# Altium project Sayma_RTM.PrjPcb (part 10 of 11)

## Sheet CLK_HMC7043.SchDoc: Sayma RTM
size 420 x 297 mm; Author: G.Kasprowicz; CompanyName: WUT ISE; DrawnBy: G.Kasprowicz; Organization: WUT ISE; Address1: PW ISE; Address2: Nowowiejska 15/19 00-665 Warsaw; Address3: gkasprow@gmail.com; DocumentNumber: 5; Revision: 1.0; SheetNumber: 5; SheetTotal: 18; ModifiedBy: -; CheckedDate: -; Title2: HMC7043 clock distribution; DivGrp: WUT ISE; Designer: G.Kasprowicz; ModifiedDate: -; ProjectName: Sensor Box
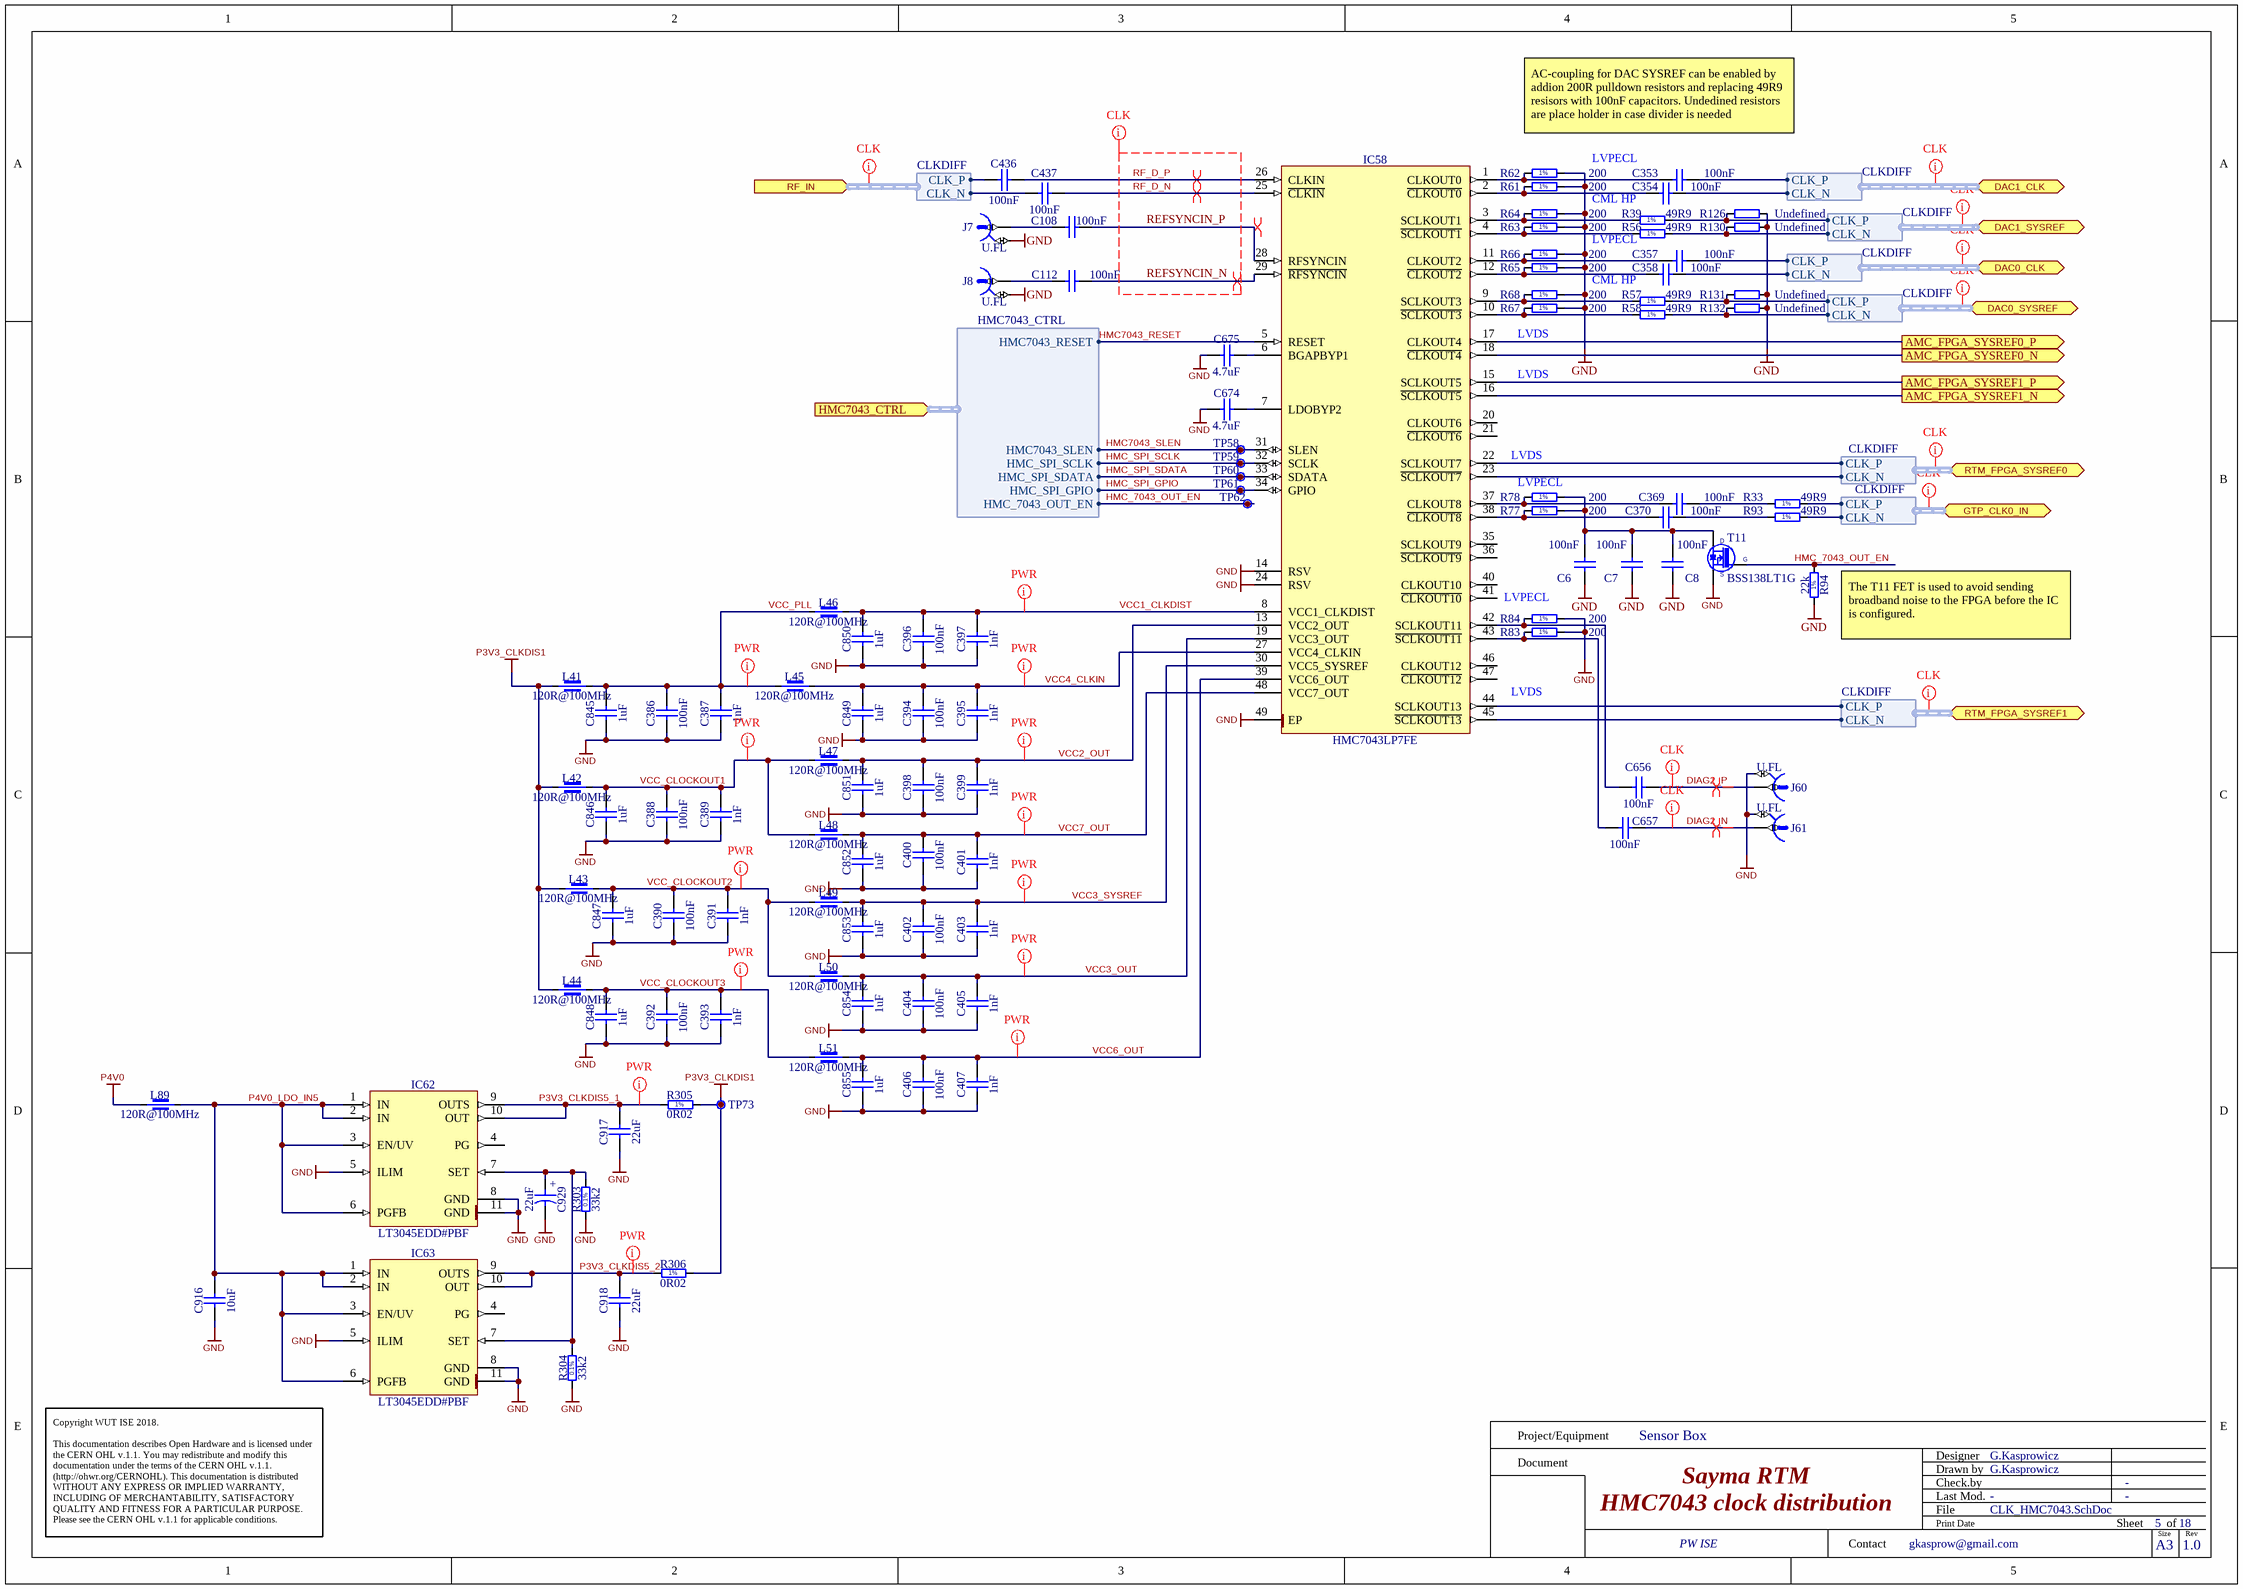
[diagram p15: CLK_HMC7043.SchDoc]

### Parts
C6  100nF  [CAPC0603X33N]
C7  100nF  [CAPC0603X33N]
C8  100nF  [CAPC0603X33N]
C108  100nF  [CAPC0603X33N]
C112  100nF  [CAPC0603X33N]
C353  100nF  [CAPC0603X33N]
C354  100nF  [CAPC0603X33N]
C357  100nF  [CAPC0603X33N]
C358  100nF  [CAPC0603X33N]
C369  100nF  [CAPC0603X33N]
C370  100nF  [CAPC0603X33N]
C386  100nF  [CAPC0603X33N]
C387  1nF  [CAPC0603X33N]
C388  100nF  [CAPC0603X33N]
C389  1nF  [CAPC0603X33N]
C390  100nF  [CAPC0603X33N]
C391  1nF  [CAPC0603X33N]
C392  100nF  [CAPC0603X33N]
C393  1nF  [CAPC0603X33N]
C394  100nF  [CAPC0603X33N]
C395  1nF  [CAPC0603X33N]
C396  100nF  [CAPC0603X33N]
C397  1nF  [CAPC0603X33N]
C398  100nF  [CAPC0603X33N]
C399  1nF  [CAPC0603X33N]
C400  100nF  [CAPC0603X33N]
C401  1nF  [CAPC0603X33N]
C402  100nF  [CAPC0603X33N]
C403  1nF  [CAPC0603X33N]
C404  100nF  [CAPC0603X33N]
C405  1nF  [CAPC0603X33N]
C406  100nF  [CAPC0603X33N]
C407  1nF  [CAPC0603X33N]
C436  100nF  [CAPC0603X33N]
C437  100nF  [CAPC0603X33N]
C656  100nF  [CAPC0603X33N]
C657  100nF  [CAPC0603X33N]
C674  4.7uF  [CAPC1608X90N]
C675  4.7uF  [CAPC1608X90N]
C845  1uF  [CAPC1005X55N]
C846  1uF  [CAPC1005X55N]
C847  1uF  [CAPC1005X55N]
C848  1uF  [CAPC1005X55N]
C849  1uF  [CAPC1005X55N]
C850  1uF  [CAPC1005X55N]
C851  1uF  [CAPC1005X55N]
C852  1uF  [CAPC1005X55N]
C853  1uF  [CAPC1005X55N]
C854  1uF  [CAPC1005X55N]
C855  1uF  [CAPC1005X55N]
C916  10uF  [CAPC1608X87N]
C917  22uF  [CAPC2012X135N]
C918  22uF  [CAPC2012X135N]
C929  22uF  [CAPMP3216X180N]
IC58  HMC7043LP7FE  [QFN50P700X700X100-49N-S565]
IC62  LT3045EDD#PBF  [SON50P300X300X80-11N-R175X248]
IC63  LT3045EDD#PBF  [SON50P300X300X80-11N-R175X248]
J7  U.FL  [HIROSE_U.FL-R-SMT-1(10)]
J8  U.FL  [HIROSE_U.FL-R-SMT-1(10)]
J60  U.FL  [HIROSE_U.FL-R-SMT-1(10)]
J61  U.FL  [HIROSE_U.FL-R-SMT-1(10)]
L41  120R@100MHz  [INDC1608X95N]
L42  120R@100MHz  [INDC1608X95N]
L43  120R@100MHz  [INDC1608X95N]
L44  120R@100MHz  [INDC1608X95N]
L45  120R@100MHz  [INDC1608X95N]
L46  120R@100MHz  [INDC1608X95N]
L47  120R@100MHz  [INDC1608X95N]
L48  120R@100MHz  [INDC1608X95N]
L49  120R@100MHz  [INDC1608X95N]
L50  120R@100MHz  [INDC1608X95N]
L51  120R@100MHz  [INDC1608X95N]
L89  120R@100MHz  [INDC1608X95N]
R33  49R9  [RESC1005X40N]
R39  49R9  [RESC1005X40N]
R56  49R9  [RESC1005X40N]
R57  49R9  [RESC1005X40N]
R58  49R9  [RESC1005X40N]
R61  200  [RESC1005X40N]
R62  200  [RESC1005X40N]
R63  200  [RESC1005X40N]
R64  200  [RESC1005X40N]
R65  200  [RESC1005X40N]
R66  200  [RESC1005X40N]
R67  200  [RESC1005X40N]
R68  200  [RESC1005X40N]
R77  200  [RESC1005X40N]
R78  200  [RESC1005X40N]
R83  200  [RESC1005X40N]
R84  200  [RESC1005X40N]
R93  49R9  [RESC1005X40N]
R94  22k  [RESC1005X40N]
R126  Undefined  [RESC1005X40N]
R130  Undefined  [RESC1005X40N]
R131  Undefined  [RESC1005X40N]
R132  Undefined  [RESC1005X40N]
R303  33k2  [RESC1608X55N]
R304  33k2  [RESC1608X55N]
R305  0R02  [RESC3216X80N]
R306  0R02  [RESC3216X80N]
T11  BSS138LT1G  [SOT95P240X110-3N]
TP58  Test Point  [TPS127]  (value not drawn)
TP59  Test Point  [TPS127]  (value not drawn)
TP60  Test Point  [TPS127]  (value not drawn)
TP61  Test Point  [TPS127]  (value not drawn)
TP62  Test Point  [TPS127]  (value not drawn)
TP73  Test Point  [TPS127]  (value not drawn)

### Ports
AMC_FPGA_SYSREF0_N (out), AMC_FPGA_SYSREF0_P (out), AMC_FPGA_SYSREF1_N (out), AMC_FPGA_SYSREF1_P (out), DAC0_CLK (bidir, harness CLKDIFF), DAC0_SYSREF (bidir, harness CLKDIFF), DAC1_CLK (bidir, harness CLKDIFF), DAC1_SYSREF (bidir, harness CLKDIFF), GTP_CLK0_IN (bidir, harness CLKDIFF), HMC7043_CTRL (in, harness HMC7043_CTRL), RF_IN (in, harness CLKDIFF), RTM_FPGA_SYSREF0 (bidir, harness CLKDIFF), RTM_FPGA_SYSREF1 (bidir, harness CLKDIFF)

### Harnesses
HMC7043_CTRL: HMC7043_RESET, HMC_SPI_SDATA, HMC7043_SLEN, HMC_SPI_SCLK, HMC_SPI_GPIO, HMC_7043_OUT_EN
CLKDIFF: CLK_P, CLK_N
CLKDIFF: CLK_N, CLK_P

### Nets
GND: C6.1 C7.1 C8.1 C386.1 C387.1 C388.1 C389.1 C390.1 C391.1 C392.1 C393.1 C394.1 C395.1 C396.1 C397.1 C398.1 C399.1 C400.1 C401.1 C402.1 C403.1 C404.1 C405.1 C406.1 C407.1 C674.1 C675.1 C845.2 C846.2 C847.2 C848.2 C849.2 C850.2 C851.2 C852.2 C853.2 C854.2 C855.2 C916.1 C917.1 C918.1 C929.2 IC58.14(RSV) IC58.24(RSV) IC58.49(EP) IC62.5(ILIM) IC62.8(GND) IC62.11(GND) IC63.5(ILIM) IC63.8(GND) IC63.11(GND) J7.2 J8.2 J60.2 J61.2 R61.2 R62.2 R63.2 R64.2 R65.2 R66.2 R67.2 R68.2 R83.2 R84.2 R94.1 R126.2 R130.2 R131.2 R132.2 R303.1 R304.1 T11.2(S)
P3V3_CLKDIS1: L41.1 L42.1 L43.1 L44.1 R305.2 R306.2 TP73.1
P4V0: L89.1
AMC_LVDS.LVDS21_N: IC58.18(~{CLKOUT4}) ; port AMC_FPGA_SYSREF0_N
AMC_LVDS.LVDS21_P: IC58.17(CLKOUT4) ; port AMC_FPGA_SYSREF0_P
AMC_LVDS.LVDS30_N: IC58.16(~{SCLKOUT5}) ; port AMC_FPGA_SYSREF1_N
AMC_LVDS.LVDS30_P: IC58.15(SCLKOUT5) ; port AMC_FPGA_SYSREF1_P
DAC_CLK_N: C354.2 ; port DAC1_CLK.CLK_N
DAC_CLK_N: C358.2 ; port DAC0_CLK.CLK_N  [a separate net that carries the same name]
DAC_CLK_P: C353.2 ; port DAC1_CLK.CLK_P
DAC_CLK_P: C357.2 ; port DAC0_CLK.CLK_P  [a separate net that carries the same name]
DAC_SYSREF_N: R56.2 R130.1 ; port DAC1_SYSREF.CLK_N
DAC_SYSREF_N: R58.2 R132.1 ; port DAC0_SYSREF.CLK_N  [a separate net that carries the same name]
DAC_SYSREF_P: R39.2 R126.1 ; port DAC1_SYSREF.CLK_P
DAC_SYSREF_P: R57.2 R131.1 ; port DAC0_SYSREF.CLK_P  [a separate net that carries the same name]
DIAG2_N: C657.2 J61.1
DIAG2_P: C656.2 J60.1
GT_CLK0_IN_N: R93.2 ; port GTP_CLK0_IN.CLK_N
GT_CLK0_IN_P: R33.2 ; port GTP_CLK0_IN.CLK_P
HMC7043_RESET: IC58.5(RESET) ; port HMC7043_CTRL.HMC7043_RESET
HMC7043_SLEN: IC58.31(SLEN) TP58.1 ; port HMC7043_CTRL.HMC7043_SLEN
HMC_7043_OUT_EN: R94.2 T11.1(G) TP62.1 ; port HMC7043_CTRL.HMC_7043_OUT_EN
HMC_SPI_GPIO: IC58.34(GPIO) TP61.1 ; port HMC7043_CTRL.HMC_SPI_GPIO
HMC_SPI_SCLK: IC58.32(SCLK) TP59.1 ; port HMC7043_CTRL.HMC_SPI_SCLK
HMC_SPI_SDATA: IC58.33(SDATA) TP60.1 ; port HMC7043_CTRL.HMC_SPI_SDATA
P3V3_CLKDIS5_1: C917.2 IC62.9(OUTS) IC62.10(OUT) R305.1
P3V3_CLKDIS5_2: C918.2 IC63.9(OUTS) IC63.10(OUT) R306.1
P4V0_LDO_IN5: C916.2 IC62.1(IN) IC62.2(IN) IC62.3(EN/UV) IC62.6(PGFB) IC63.1(IN) IC63.2(IN) IC63.3(EN/UV) IC63.6(PGFB) L89.2
REFSYNCIN_N: C112.2 IC58.29(~{RFSYNCIN})
REFSYNCIN_P: C108.2 IC58.28(RFSYNCIN)
RF_D_N: C437.2 IC58.25(~{CLKIN})
RF_D_P: C436.2 IC58.26(CLKIN)
RF_OUT_N: C437.1 ; port RF_IN.CLK_N
RF_OUT_P: C436.1 ; port RF_IN.CLK_P
RTM_FPGA_SYSREF0_N: IC58.23(~{SCLKOUT7}) ; port RTM_FPGA_SYSREF0.CLK_N
RTM_FPGA_SYSREF0_P: IC58.22(SCLKOUT7) ; port RTM_FPGA_SYSREF0.CLK_P
RTM_FPGA_SYSREF1_N: IC58.45(~{SCLKOUT13}) ; port RTM_FPGA_SYSREF1.CLK_N
RTM_FPGA_SYSREF1_P: IC58.44(SCLKOUT13) ; port RTM_FPGA_SYSREF1.CLK_P
VCC1_CLKDIST: C396.2 C397.2 C850.1 IC58.8(VCC1_CLKDIST) L46.2
VCC2_OUT: C398.2 C399.2 C851.1 IC58.13(VCC2_OUT) L47.2
VCC3_OUT: C404.2 C405.2 C854.1 IC58.19(VCC3_OUT) L50.2
VCC3_SYSREF: C402.2 C403.2 C853.1 IC58.30(VCC5_SYSREF) L49.2
VCC4_CLKIN: C394.2 C395.2 C849.1 IC58.27(VCC4_CLKIN) L45.2
VCC6_OUT: C406.2 C407.2 C855.1 IC58.39(VCC6_OUT) L51.2
VCC7_OUT: C400.2 C401.2 C852.1 IC58.48(VCC7_OUT) L48.2
VCC_CLOCKOUT1: C388.2 C389.2 C846.1 L42.2 L47.1 L48.1
VCC_CLOCKOUT2: C390.2 C391.2 C847.1 L43.2 L49.1 L50.1
VCC_CLOCKOUT3: C392.2 C393.2 C848.1 L44.2 L51.1
VCC_PLL: C386.2 C387.2 C845.1 L41.2 L45.1 L46.1
NetC6_2: C6.2 C7.2 C8.2 R77.2 R78.2 T11.3(D)
NetC108_1: C108.1 J7.1
NetC112_1: C112.1 J8.1
NetC353_1: C353.1 IC58.1(CLKOUT0) R62.1
NetC354_1: C354.1 IC58.2(~{CLKOUT0}) R61.1
NetC357_1: C357.1 IC58.11(CLKOUT2) R66.1
NetC358_1: C358.1 IC58.12(~{CLKOUT2}) R65.1
NetC369_1: C369.1 IC58.37(CLKOUT8) R78.1
NetC369_2: C369.2 R33.1
NetC370_1: C370.1 IC58.38(~{CLKOUT8}) R77.1
NetC370_2: C370.2 R93.1
NetC656_1: C656.1 IC58.42(SCLKOUT11) R84.1
NetC657_1: C657.1 IC58.43(~{SCLKOUT11}) R83.1
NetC674_2: C674.2 IC58.7(LDOBYP2)
NetC675_2: C675.2 IC58.6(BGAPBYP1)
NetC929_1: C929.1 IC62.7(SET) IC63.7(SET) R303.2 R304.2
NetIC58_3: IC58.3(SCLKOUT1) R39.1 R64.1
NetIC58_4: IC58.4(~{SCLKOUT1}) R56.1 R63.1
NetIC58_9: IC58.9(SCLKOUT3) R57.1 R68.1
NetIC58_10: IC58.10(~{SCLKOUT3}) R58.1 R67.1

Not connected (* = marked no-connect by the designer): IC58 20(CLKOUT6) 21(~{CLKOUT6}) 35(SCLKOUT9) 36(~{SCLKOUT9}) 40(CLKOUT10) 41(~{CLKOUT10}) 46(CLKOUT12) 47(~{CLKOUT12}); IC62 4(PG); IC63 4(PG)

### Layout directives
net class CLK: (no net found under the mark), DIAG2_N, DIAG2_P, REFSYNCIN_N, REFSYNCIN_P, RF_D_N, RF_D_P
differential pair: DIAG2_N, DIAG2_P, REFSYNCIN_N, REFSYNCIN_P, RF_D_N, RF_D_P
net class PWR: P3V3_CLKDIS5_1, P3V3_CLKDIS5_2, VCC1_CLKDIST, VCC2_OUT, VCC3_OUT, VCC3_SYSREF, VCC4_CLKIN, VCC6_OUT, VCC7_OUT, VCC_CLOCKOUT1, VCC_CLOCKOUT2, VCC_CLOCKOUT3, VCC_PLL

### Notes on the sheet
- AC-coupling for DAC SYSREF can be enabled by addion 200R pulldown resistors and replacing 49R9 resisors with 100nF capacitors. Undedined resistors are place holder in case divider is needed
- LVPECL
- CML HP
- LVDS
- (near R78) LVPECL
- (near R84) LVPECL
- (near R94) The T11 FET is used to avoid sending broadband noise to the FPGA before the IC is configured.
- Project/Equipment
- Document
- Designer
- Drawn by
- Check.by
- Copyright WUT ISE 2018.
  This documentation describes Open Hardware and is licensed under the CERN OHL v.1.1. You may redistribute and modify this documentation under the terms of the CERN OHL v.1.1. (http://ohwr.org/CERNOHL). This documentation is distributed WITHOUT ANY EXPRESS OR IMPLIED WARRANTY, INCLUDING OF MERCHANTABILITY, SATISFACTORY QUALITY AND FITNESS FOR A PARTICULAR PURPOSE. Please see the CERN OHL v.1.1 for applicable conditions.
- Contact
- File
- Last Mod.
- Print Date
- Sheet
- Size
- A3
- of
- Rev
- (in symbol CTE3216-18_22UF_6.3V_10%_LESR0900) +
- (in symbol R0402_22K_1%_0.0625W_100PPM) 1%
- (in symbol R0402_49R9_1%_0.0625W_100PPM) 1%
- (in symbol R0402_200R_1%_0.0625W_100PPM) 1%
- (in symbol R0603_33K2_0.1%_0.063W_10PPM) 0.1%
- (in symbol R1206_0R02_1%_0.5W_100PPM) 1%

### Library data of the parts
C6-C8 C108 C112 C353 C354 C357 C358 C369 C370 C386 C388 C390 C392 C394 C396 C398 C400 C402 C404 C406 C436 C437 C656 C657 = CC0201_100NF_6.3V_10%_X5R: Non-polarised capacitor; Manufacturer: GENERIC; Part Description: SMD Multilayer Chip Ceramic Capacitor; Manufacturer1 Part Number: 02016D104KAT2A; Tolerance: ±10%; Voltage: 6.3V; TC: X5R; Manufacturer Part Number: CC0201_100NF_6.3V_10%_X5R; Part Number: CC0201_100NF_6.3V_10%_X5R; Component Kind: Standard; Component Type: Standard; Pin Count: 2; Value: 100nF; Status: Not Recommended; Case: 0201; Mounted: Yes; Socket: No; SMD: Yes; Sense: No; Manufacturer1 Example: AVX; Manufacturer1 ComponentHeight: 0.33mm; HelpURL: \\cern.ch\dfs\Applications\Altium\Datasheets\CC0201_X5R_AVX.pdf; Author: CERN DEM JLC; CreateDate: 03.12.2007; LatestRevisionDate: 03.12.2007
C387 C389 C391 C393 C395 C397 C399 C401 C403 C405 C407 = CC0201_1NF_16V_10%_X5R: Non-polarised capacitor; Manufacturer: GENERIC; Part Description: SMD Multilayer Chip Ceramic Capacitor; Manufacturer1 Part Number: 0201YD102KAT2A; Tolerance: ±10%; Voltage: 16V; TC: X5R; Manufacturer Part Number: CC0201_1NF_16V_10%_X5R; Part Number: CC0201_1NF_16V_10%_X5R; Value: 1nF; Component Kind: Standard; Component Type: Standard; Pin Count: 2; Status: Not Recommended; Case: 0201; Mounted: Yes; Socket: No; SMD: Yes; Sense: No; Manufacturer1 Example: AVX; Manufacturer1 ComponentHeight: 0.33mm; HelpURL: \\cern.ch\dfs\Applications\Altium\Datasheets\CC0201_X5R_AVX.pdf; Author: CERN DEM JLC; CreateDate: 03.12.2007; LatestRevisionDate: 03.12.2007
C674 C675 = CC0603_4.7UF_25V_10%_X5R: Non-polarised capacitor; Manufacturer: GENERIC; Part Description: SMD Multilayer Chip Ceramic Capacitor; Manufacturer1 Part Number: GRM188R61E475KE11D; Tolerance: ±10%; Voltage: 25V; TC: X5R; Manufacturer Part Number: CC0603_4.7UF_25V_10%_X5R; Part Number: CC0603_4.7UF_25V_10%_X5R; Value: 4.7uF; Component Kind: Standard; Component Type: Standard; Pin Count: 2; Status: None; Case: 0603; Mounted: Yes; Socket: No; SMD: Yes; Sense: No; Manufacturer1 Example: MURATA; Manufacturer1 ComponentHeight: 0.95mm; HelpURL: \\cern.ch\dfs\Applications\Altium\Datasheets\CC0603_MURATA_GRM188R61E475KE11D.pdf; Author: CERN DEM JLC; CreateDate: 10.11.2014; LatestRevisionDate: 10.11.2014
C845-C855 = CC0402_1UF_16V_10%_X5R: Non-polarised capacitor; Manufacturer: GENERIC; Part Description: SMD Multilayer Chip Ceramic Capacitor; Manufacturer1 Part Number: C1005X5R1C105KT; Tolerance: ±10%; Voltage: 16V; TC: X5R; Manufacturer Part Number: CC0402_1UF_16V_10%_X5R; Part Number: CC0402_1UF_16V_10%_X5R; Value: 1uF; Component Kind: Standard; Component Type: Standard; Pin Count: 2; Status: Preferred; Case: 0402; Mounted: Yes; Socket: No; SMD: Yes; Sense: No; Manufacturer1 Example: TDK; Manufacturer1 ComponentHeight: 0.55mm; HelpURL: \\cern.ch\dfs\Applications\Altium\Datasheets\CC0402_X5R_TDK_C.pdf; Author: CERN DEM JLC; CreateDate: 25.10.2012; LatestRevisionDate: 25.10.2012
C916 = CC0603_10uF_6.3V_20%_X5R: Non-polarised capacitor; Manufacturer: GENERIC; Part Description: SMD Multilayer Chip Ceramic Capacitor; Manufacturer1 Part Number: C0603C106M9PAC; Tolerance: ±20%; Voltage: 6.3V; TC: X5R; Manufacturer Part Number: CC0603_10uF_6.3V_20%_X5R; Part Number: CC0603_10UF_6.3V_20%_X5R; Value: 10uF; Component Kind: Standard; Component Type: Standard; Pin Count: 2; Status: Preferred; Case: 0603; Mounted: Yes; Socket: No; SMD: Yes; Sense: No; Manufacturer1 Example: KEMET; Manufacturer1 ComponentHeight: 0.95mm; HelpURL: \\cern.ch\dfs\Applications\Altium\Datasheets\CC0603_X5R_KEMET.pdf; Author: CERN DEM JLC; CreateDate: 03.12.2007; LatestRevisionDate: 03.12.2007
C917 C918 = CC0805_22UF_16V_10%_X5R: Non-polarised capacitor; Manufacturer: GENERIC; Part Description: SMD Multilayer Chip Ceramic Capacitor; Manufacturer1 Part Number: C2012X5R1C226KT; Tolerance: ±10%; Voltage: 16V; TC: X5R; Manufacturer Part Number: CC0805_22UF_16V_10%_X5R; Part Number: CC0805_22UF_16V_10%_X5R; Value: 22uF; Component Kind: Standard; Component Type: Standard; Pin Count: 2; Status: Preferred; Case: 0805; Mounted: Yes; Socket: No; SMD: Yes; Sense: No; Manufacturer1 Example: TDK; Manufacturer1 ComponentHeight: 1.35mm; HelpURL: \\cern.ch\dfs\Applications\Altium\Datasheets\CC0805_X5R_TDK_C.pdf; Author: CERN DEM JLC; CreateDate: 25.10.2012; LatestRevisionDate: 25.10.2012
C929 = CTE3216-18_22UF_6.3V_10%_LESR0900: Polarised capacitor; Manufacturer: GENERIC; Part Description: Low ESR 0R9 Solid Tantalum Chip Capacitor; Manufacturer1 Part Number: TPSA226K006R0900; Tolerance: ±10%; Voltage: 6.3V; Manufacturer Part Number: CTE3216-18_22UF_6.3V_10%_LESR0900; Part Number: CTE3216-18_22UF_6.3V_10%_LESR0900; Value: 22uF; Component Kind: Standard; Component Type: Standard; Pin Count: 2; Status: Preferred; Case: A; Mounted: Yes; Socket: No; SMD: Yes; Sense: No; Manufacturer1 Example: AVX; Manufacturer1 ComponentHeight: 1.8mm; HelpURL: \\cern.ch\dfs\Applications\Altium\Datasheets\CTE-LESR_AVX_TPS.pdf; Author: CERN DEM JLC; CreateDate: 05.05.2008; LatestRevisionDate: 20.01.2009
IC58 = HMC7043LP7FE: High Performance, 3.2 GHz, 14-Output Fanout Buffer; Manufacturer: ANALOG DEVICES; PressFit: No; Bonding: No; Manufacturer Part Number: HMC7043LP7FE; PackageDescription: QFN, 0.50mm Pitch, Square; 48 Pin, 7.00mm L X 7.00mm W X 1.00mm H Body (w/thermal Tab 5.65mm X 5.65mm), IPC Medium Density; Part Description: High Performance, 3.2GHz, 14-Output Fanout Buffer; Part Number: HMC7043LP7FE; Component Kind: Standard; Component Type: Standard; Device: HMC7043LP7FE; Pin Count: 49; Case: QFN48; Mounted: Yes; Socket: No; SMD: Yes; Sense: No; ComponentHeight: 0.9mm; Author: CERN DEM BC; HelpURL: \\cern.ch\dfs\Applications\Altium\Datasheets\HMC7043LP7FE.pdf; CreateDate: 15.08.2016; LatestRevisionDate: 15.08.2016
IC62 IC63 = LT3045EDD#PBF: 20V, 500mA, Ultralow Noise, Ultrahigh PSRR Linear Regulator; Manufacturer: LINEAR TECHNOLOGY; PressFit: No; Bonding: No; Manufacturer Part Number: LT3045EDD#PBF; PackageDescription: SON, 0.50mm Pitch, 10-pin, 3.00mm W  X 3.00mm L X 0.80mm Height, (w/thermal tab 1.75 X 2.48 mm), IPC Medium Density; Part Description: 20V, 500mA, Ultralow Noise, Ultrahigh PSRR Linear Regulator; Part Number: LT3045EDD#PBF; Component Kind: Standard; Component Type: Standard; Device: LT3045EDD#PBF; Pin Count: 11; Case: SON10; Mounted: Yes; Socket: No; SMD: Yes; Sense: No; ComponentHeight: 0.8mm; HelpURL: \\cern.ch\dfs\Applications\Altium\Datasheets\LT3045EDD#PBF.pdf; Author: CERN DEM JLC; CreateDate: 07.12.2016; LatestRevisionDate: 07.12.2016
J7 J8 J60 J61 = HIROSE_U.FL-R-SMT-1(10): Manufacturer: HIROSE (HRS); Part Description: Up to 6GHz Ultra Small Surface Mount Male Coaxial Connectors U.FL Series; PressFit: No; Manufacturer Part Number: U.FL-R-SMT-1(10); Part Number: HIROSE_U.FL-R-SMT-1(10); Component Kind: Standard; Component Type: Standard; Pin Count: 2; Family: U.FL; Mounted: Yes; Socket: No; SMD: Yes; Sense: No; Status: None; ComponentHeight: 1.25mm; HelpURL: \\cern.ch\dfs\Applications\Altium\Datasheets\HIROSE_U.FL-R-SMT-1(10).pdf; Author: CERN DEM JLC; CreateDate: 24.03.2010; LatestRevisionDate: 24.03.2010
L41-L51 L89 = IND0603_MURATA_BLM18PG121SN1D: Manufacturer: MURATA; Part Description: SMD EMIFIL Chip Ferrite Bead; Power: 2A; Resistance: 0.05R; Manufacturer Part Number: BLM18PG121SN1D; Part Number: IND0603_MURATA_BLM18PG121SN1D; Value: 120R@100MHz; Component Kind: Standard; Component Type: Standard; Pin Count: 2; Status: None; Case: 0603; Mounted: Yes; Socket: No; SMD: Yes; Sense: No; ComponentHeight: 0.95mm; HelpURL: \\cern.ch\dfs\Applications\Altium\Datasheets\IND0603_MURATA_BLM18P.pdf; Author: CERN DEM BC; CreateDate: 27.07.2015; LatestRevisionDate: 25.10.2018
R33 R39 R56-R58 R93 = R0402_49R9_1%_0.0625W_100PPM: Resistor - 1%; Manufacturer: GENERIC; Manufacturer1 Part Number: 232270674999L or RC0402FR-0749R9L; Part Description: General Purpose Thick Film Chip Resistor; TC: ±100ppm/°C; PressFit: No; Case: 0402; Manufacturer Part Number: R0402_49R9_1%_0.0625W_100PPM; Manufacturer1 ComponentHeight: 0.4mm; Manufacturer1 Example: YAGEO PHYCOMP; Part Number: R0402_49R9_1%_0.0625W_100PPM; Pin Count: 2; Power: 0.0625W; Sense: No; SMD: Yes; Status: Not Recommended; Tolerance: ±1%; Value: 49R9; Component Kind: Standard; Component Type: Standard; Mounted: Yes; Socket: No; HelpURL: \\cern.ch\dfs\Applications\Altium\Datasheets\R0402_Phycomp_RC0402.pdf; Author: CERN DEM JLC; CreateDate: 24.10.2012; LatestRevisionDate: 24.10.2012
R61-R68 R77 R78 R83 R84 = R0402_200R_1%_0.0625W_100PPM: Resistor - 1%; Manufacturer: GENERIC; Part Description: General Purpose Thick Film Chip Resistor; Manufacturer1 Part Number: 232270672001L; TC: ±100ppm/°C; PressFit: No; Manufacturer Part Number: R0402_200R_1%_0.0625W_100PPM; Part Number: R0402_200R_1%_0.0625W_100PPM; Tolerance: ±1%; Value: 200; Component Kind: Standard; Component Type: Standard; Pin Count: 2; Status: Not Recommended; Power: 0.0625W; Case: 0402; Mounted: Yes; Sense: No; Socket: No; SMD: Yes; Manufacturer1 Example: YAGEO PHYCOMP; Manufacturer1 ComponentHeight: 0.4mm; HelpURL: \\cern.ch\dfs\Applications\Altium\Datasheets\R0402_Phycomp_RC0402.pdf; Author: CERN DEM JLC; CreateDate: 03.12.2007; LatestRevisionDate: 17.10.2012
R94 = R0402_22K_1%_0.0625W_100PPM: Resistor - 1%; Manufacturer: GENERIC; Manufacturer1 Part Number: 232270672203L; Part Description: General Purpose Thick Film Chip Resistor; TC: ±100ppm/°C; PressFit: No; Case: 0402; Manufacturer Part Number: R0402_22K_1%_0.0625W_100PPM; Manufacturer1 ComponentHeight: 0.4mm; Manufacturer1 Example: YAGEO PHYCOMP; Part Number: R0402_22K_1%_0.0625W_100PPM; Pin Count: 2; Power: 0.0625W; Sense: No; SMD: Yes; Status: Not Recommended; Tolerance: ±1%; Value: 22k; Component Kind: Standard; Component Type: Standard; Mounted: Yes; Socket: No; HelpURL: \\cern.ch\dfs\Applications\Altium\Datasheets\R0402_Phycomp_RC0402.pdf; Author: CERN DEM JLC; CreateDate: 03.12.2007; LatestRevisionDate: 17.10.2012
R126 R130-R132 = R0402_NO-VALUE: Resistor; Part Description: Reserved Footprint For a 0402 (1005) Chip Resistor; PressFit: No; Mounted: No; Part Number: R0402_NO-VALUE; Component Kind: Standard; Component Type: Standard; Pin Count: 2; Value: Undefined; Status: None; Manufacturer: Undefined; Manufacturer Part Number: R0402_NO-VALUE; Case: 0402; Sense: No; Socket: No; SMD: Yes; Manufacturer1 Example: Undefined; Manufacturer1 Part Number: Undefined; Manufacturer1 ComponentHeight: Undefined; HelpURL: Undefined; Author: CERN DEM JLC; CreateDate: 03.12.2007; LatestRevisionDate: 13.03.2008
R303 R304 = R0603_33K2_0.1%_0.063W_10PPM: Resistor - 0.1%; Manufacturer: GENERIC; Part Description: Thin Film Chip Resistor; Manufacturer1 Part Number: RN73C1J33K2BTDF; Power: 0.063W; TC: ±10ppm; PressFit: No; Manufacturer Part Number: R0603_33K2_0.1%_0.063W_10PPM; Part Number: R0603_33K2_0.1%_0.063W_10PPM; Tolerance: ±0.1%; Value: 33k2; Component Kind: Standard; Component Type: Standard; Pin Count: 2; Status: Not Recommended; Case: 0603; Mounted: Yes; Sense: No; Socket: No; SMD: Yes; Manufacturer1 Example: TYCO HOLSWORTHY; Manufacturer1 ComponentHeight: 0.5mm; HelpURL: \\cern.ch\dfs\Applications\Altium\Datasheets\R0603_Tyco_RN73.pdf; Author: CERN DEM JLC; CreateDate: 03.12.2007; LatestRevisionDate: 13.03.2008
R305 R306 = R1206_0R02_1%_0.5W_100PPM: Resistor - 1%; Manufacturer Part Number: LRF1206-R020FI; Manufacturer: TT Electronics; Part Description: Low Value Flat Chip Resistor; Power: 0.5W; TC: ±100ppm/°C; PressFit: No; Part Number: R1206_0R02_1%_0.5W_100PPM; Tolerance: ±1%; Value: 0R02; Component Kind: Standard; Component Type: Standard; Pin Count: 2; Status: None; Case: 1206; Mounted: Yes; Sense: No; Socket: No; SMD: Yes; ComponentHeight: 0.8mm; HelpURL: \\cern.ch\dfs\Applications\Altium\Datasheets\R1206_WELWYN_LRF.pdf; Author: CERN DEM JLC; CreateDate: 11.05.2010; LatestRevisionDate: 03.09.2012
T11 = BSS138LT1G: N-CHANNEL MOSFET WITH DIODE; Manufacturer: ON SEMICONDUCTOR; Part Description: 50V 200mA N-Channel Enhancement Mode Field-Effect Transistor; Bonding: No; PressFit: No; Case: SOT23-3; ComponentHeight: 1.11mm; Device: BSS138LT1G; Manufacturer Part Number: BSS138LT1G; Mounted: Yes; PackageDescription: SOT23 3-Leads, Pitch 0.95mm - Body 1.4x3mm, IPC Medium Density; Part Number: BSS138LT1G; Pin Count: 3; Sense: No; SMD: Yes; Socket: No; Component Kind: Standard; Component Type: Standard; HelpURL: \\cern.ch\dfs\Applications\Altium\Datasheets\BSS138LT1G.pdf; Author: CERN DEM JLC; CreateDate: 23.03.2009; LatestRevisionDate: 23.03.2009
TP58-TP62 TP73 = SMD_PAD_1.27X1.27MM: Part Description: 1.27mm x 1.27mm PCB Copper Area (SMD Test Point); Mounted: No; ComponentHeight: 0mm; Family: Test Point; Part Number: SMD_PAD_1.27X1.27MM; Pin Count: 1; Sense: No; SMD: Yes; Socket: No; Status: None; Component Kind: Standard (No BOM); Component Type: Standard (No BOM); HelpURL: Undefined; Author: CERN DEM JLC; CreateDate: 12.01.2008; LatestRevisionDate: 12.01.2008; PackageDescription: 1.27mm x 1.27mm PCB Copper Area (SMD Test Point)

## Sheet FPGA_7A35T_GTP.SchDoc: Sayma RTM
size 420 x 297 mm; Author: G.Kasprowicz; CompanyName: WUT ISE; DrawnBy: G.Kasprowicz; Organization: WUT ISE; Address1: PW ISE; Address2: Nowowiejska 15/19 00-665 Warsaw; Address3: gkasprow@gmail.com; DocumentNumber: 10; Revision: 1.0; SheetNumber: 10; SheetTotal: 18; ModifiedBy: -; CheckedDate: -; Title2: GTP transceivers & SATA; DivGrp: WUT ISE; Designer: G.Kasprowicz; ModifiedDate: -; ProjectName: Sensor Box
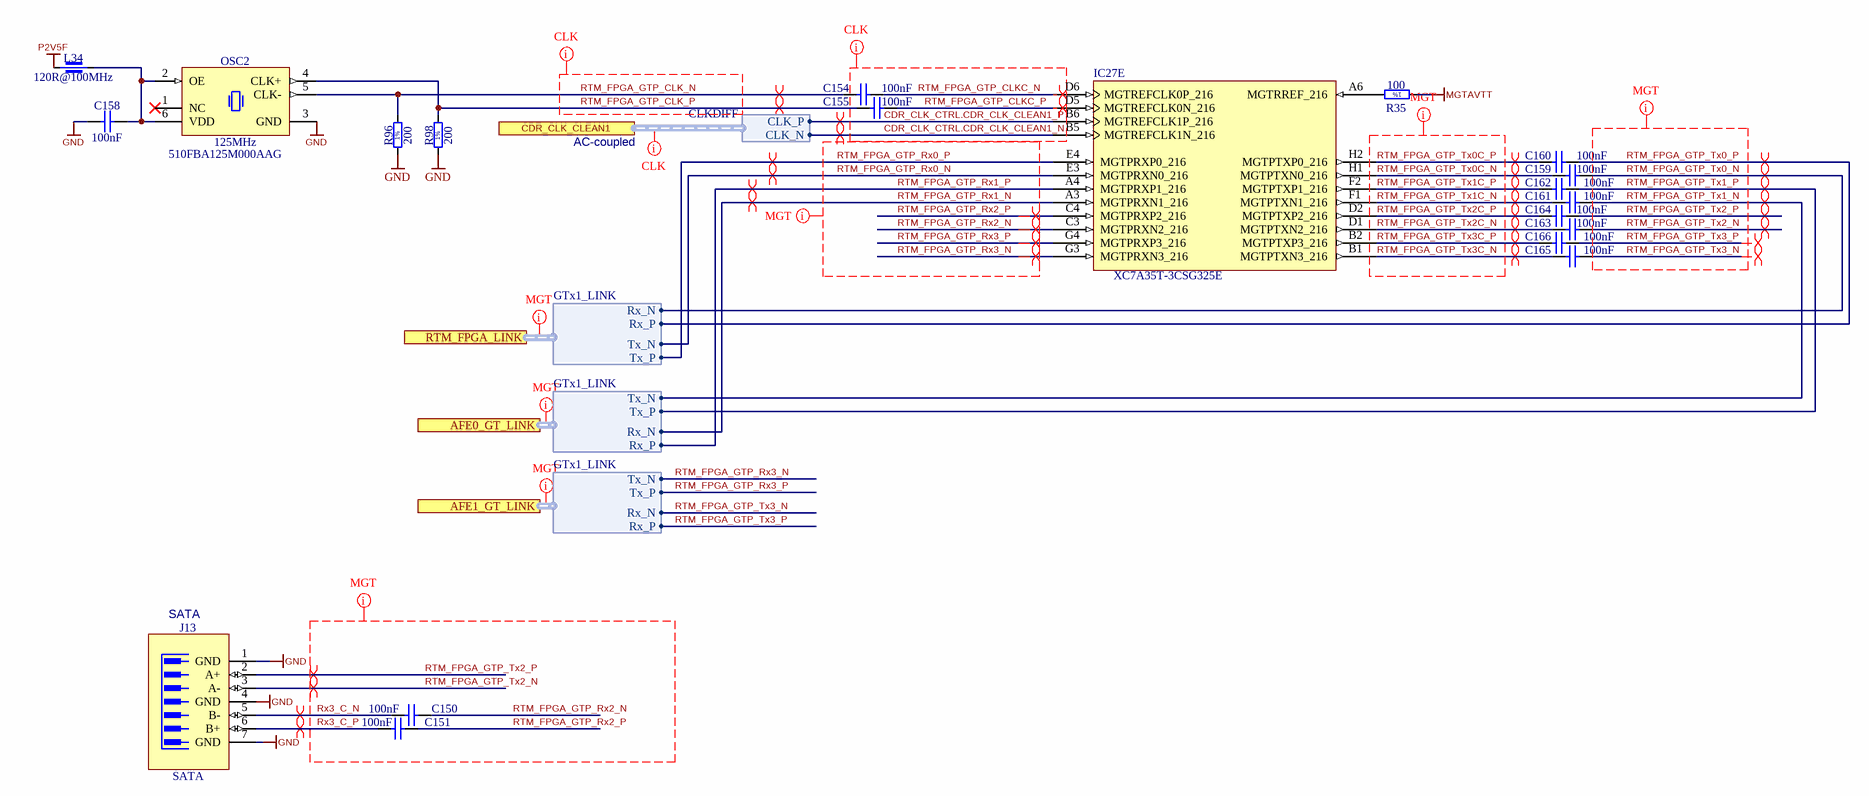
[diagram p16: FPGA_7A35T_GTP.SchDoc]

### Parts
C150  100nF  [CAPC0603X33N]
C151  100nF  [CAPC0603X33N]
C154  100nF  [CAPC0603X33N]
C155  100nF  [CAPC0603X33N]
C158  100nF  [CAPC0603X33N]
C159  100nF  [CAPC0603X33N]
C160  100nF  [CAPC0603X33N]
C161  100nF  [CAPC0603X33N]
C162  100nF  [CAPC0603X33N]
C163  100nF  [CAPC0603X33N]
C164  100nF  [CAPC0603X33N]
C165  100nF  [CAPC0603X33N]
C166  100nF  [CAPC0603X33N]
IC27  XC7A35T-3CSG325E  [CSG325]  (part E of 9)
J13  SATA  [MOLEX_67800-5005]
L34  120R@100MHz  [INDC1005X55N]
OSC2  125MHz  Manufacturer Part Number: 510FBA125M000AAG  [OSC_SILICON-LAB_SI510-6N(5X7)]
R35  100  [RESC1005X40N]
R96  200  [RESC1005X40N]
R98  200  [RESC1005X40N]

### Ports
AFE0_GT_LINK (harness GTx1_LINK), AFE1_GT_LINK (harness GTx1_LINK), CDR_CLK_CLEAN1 (harness CLKDIFF), RTM_FPGA_LINK (harness GTx1_LINK)

### Harnesses
CLKDIFF: CLK_N, CLK_P
GTx1_LINK: Rx_P, Rx_N, Tx_P, Tx_N

### Nets
GND: C158.1 J13.1(GND) J13.4(GND) J13.7(GND) OSC2.3(GND) R96.1 R98.1
MGTAVTT: R35.1
P2V5F: L34.2
CDR_CLK_CTRL.CDR_CLK_CLEAN1_N: IC27.B5(MGTREFCLK1N_216) ; port CDR_CLK_CLEAN1.CLK_N
CDR_CLK_CTRL.CDR_CLK_CLEAN1_P: IC27.B6(MGTREFCLK1P_216) ; port CDR_CLK_CLEAN1.CLK_P
RTM_FPGA_GTP_CLK_N: C154.1 OSC2.5(CLK-) R96.2
RTM_FPGA_GTP_CLK_P: C155.1 OSC2.4(CLK+) R98.2
RTM_FPGA_GTP_CLKC_N: C154.2 IC27.D6(MGTREFCLK0P_216)
RTM_FPGA_GTP_CLKC_P: C155.2 IC27.D5(MGTREFCLK0N_216)
RTM_FPGA_GTP_Rx0_N: IC27.E3(MGTPRXN0_216) ; port RTM_FPGA_LINK.Tx_N  [project net GT16TX_N]
RTM_FPGA_GTP_Rx0_P: IC27.E4(MGTPRXP0_216) ; port RTM_FPGA_LINK.Tx_P  [project net GT16TX_P]
RTM_FPGA_GTP_Rx1_N: IC27.A3(MGTPRXN1_216) ; port AFE0_GT_LINK.Rx_N
RTM_FPGA_GTP_Rx1_P: IC27.A4(MGTPRXP1_216) ; port AFE0_GT_LINK.Rx_P
RTM_FPGA_GTP_Rx2_N: C150.2 IC27.C3(MGTPRXN2_216)
RTM_FPGA_GTP_Rx2_P: C151.2 IC27.C4(MGTPRXP2_216)
RTM_FPGA_GTP_Rx3_N: IC27.G3(MGTPRXN3_216) ; port AFE1_GT_LINK.Tx_N
RTM_FPGA_GTP_Rx3_P: IC27.G4(MGTPRXP3_216) ; port AFE1_GT_LINK.Tx_P
RTM_FPGA_GTP_Tx0_N: C159.1 ; port RTM_FPGA_LINK.Rx_N  [project net GT16RX_N]
RTM_FPGA_GTP_Tx0_P: C160.1 ; port RTM_FPGA_LINK.Rx_P  [project net GT16RX_P]
RTM_FPGA_GTP_Tx0C_N: C159.2 IC27.H1(MGTPTXN0_216)
RTM_FPGA_GTP_Tx0C_P: C160.2 IC27.H2(MGTPTXP0_216)
RTM_FPGA_GTP_Tx1_N: C161.1 ; port AFE0_GT_LINK.Tx_N
RTM_FPGA_GTP_Tx1_P: C162.1 ; port AFE0_GT_LINK.Tx_P
RTM_FPGA_GTP_Tx1C_N: C161.2 IC27.F1(MGTPTXN1_216)
RTM_FPGA_GTP_Tx1C_P: C162.2 IC27.F2(MGTPTXP1_216)
RTM_FPGA_GTP_Tx2_N: C163.1 J13.3(A-)
RTM_FPGA_GTP_Tx2_P: C164.1 J13.2(A+)
RTM_FPGA_GTP_Tx2C_N: C163.2 IC27.D1(MGTPTXN2_216)
RTM_FPGA_GTP_Tx2C_P: C164.2 IC27.D2(MGTPTXP2_216)
RTM_FPGA_GTP_Tx3_N: C165.1 ; port AFE1_GT_LINK.Rx_N
RTM_FPGA_GTP_Tx3_P: C166.1 ; port AFE1_GT_LINK.Rx_P
RTM_FPGA_GTP_Tx3C_N: C165.2 IC27.B1(MGTPTXN3_216)
RTM_FPGA_GTP_Tx3C_P: C166.2 IC27.B2(MGTPTXP3_216)
Rx3_C_N: C150.1 J13.5(B-)
Rx3_C_P: C151.1 J13.6(B+)
NetC158_2: C158.2 L34.1 OSC2.2(OE) OSC2.6(VDD)
NetIC27_A6: IC27.A6(MGTRREF_216) R35.2

Not connected (* = marked no-connect by the designer): OSC2 1(NC)*

### Layout directives
net class CLK: (no net found under the mark), CDR_CLK_CTRL.CDR_CLK_CLEAN1_N, CDR_CLK_CTRL.CDR_CLK_CLEAN1_P, RTM_FPGA_GTP_CLK_N, RTM_FPGA_GTP_CLK_P, RTM_FPGA_GTP_CLKC_N, RTM_FPGA_GTP_CLKC_P
net class MGT: (no net found under the mark), RTM_FPGA_GTP_Rx0_N, RTM_FPGA_GTP_Rx0_P, RTM_FPGA_GTP_Rx1_N, RTM_FPGA_GTP_Rx1_P, RTM_FPGA_GTP_Rx2_N, RTM_FPGA_GTP_Rx2_P, RTM_FPGA_GTP_Rx3_N, RTM_FPGA_GTP_Rx3_P, RTM_FPGA_GTP_Tx0_N, RTM_FPGA_GTP_Tx0_P, RTM_FPGA_GTP_Tx0C_N, RTM_FPGA_GTP_Tx0C_P, RTM_FPGA_GTP_Tx1_N, RTM_FPGA_GTP_Tx1_P, RTM_FPGA_GTP_Tx1C_N, RTM_FPGA_GTP_Tx1C_P, RTM_FPGA_GTP_Tx2_N, RTM_FPGA_GTP_Tx2_P, RTM_FPGA_GTP_Tx2C_N, RTM_FPGA_GTP_Tx2C_P, RTM_FPGA_GTP_Tx3_N, RTM_FPGA_GTP_Tx3_P, RTM_FPGA_GTP_Tx3C_N, RTM_FPGA_GTP_Tx3C_P, Rx3_C_N, Rx3_C_P
differential pair: CDR_CLK_CTRL.CDR_CLK_CLEAN1_N, CDR_CLK_CTRL.CDR_CLK_CLEAN1_P, GT16RX_N, GT16RX_P, GT16TX_N, GT16TX_P, RTM_FPGA_GTP_CLK_N, RTM_FPGA_GTP_CLK_P, RTM_FPGA_GTP_CLKC_N, RTM_FPGA_GTP_CLKC_P, RTM_FPGA_GTP_Rx1_N, RTM_FPGA_GTP_Rx1_P, RTM_FPGA_GTP_Rx2_N, RTM_FPGA_GTP_Rx2_P, RTM_FPGA_GTP_Rx3_N, RTM_FPGA_GTP_Rx3_P, RTM_FPGA_GTP_Tx0C_N, RTM_FPGA_GTP_Tx0C_P, RTM_FPGA_GTP_Tx1_N, RTM_FPGA_GTP_Tx1_P, RTM_FPGA_GTP_Tx1C_N, RTM_FPGA_GTP_Tx1C_P, RTM_FPGA_GTP_Tx2_N, RTM_FPGA_GTP_Tx2_P, RTM_FPGA_GTP_Tx2C_N, RTM_FPGA_GTP_Tx2C_P, RTM_FPGA_GTP_Tx3_N, RTM_FPGA_GTP_Tx3_P, RTM_FPGA_GTP_Tx3C_N, RTM_FPGA_GTP_Tx3C_P, Rx3_C_N, Rx3_C_P

### Notes on the sheet
- AC-coupled
- SATA
- Project/Equipment
- Document
- Designer
- Drawn by
- Check.by
- Copyright WUT ISE 2018.
  This documentation describes Open Hardware and is licensed under the CERN OHL v.1.1. You may redistribute and modify this documentation under the terms of the CERN OHL v.1.1. (http://ohwr.org/CERNOHL). This documentation is distributed WITHOUT ANY EXPRESS OR IMPLIED WARRANTY, INCLUDING OF MERCHANTABILITY, SATISFACTORY QUALITY AND FITNESS FOR A PARTICULAR PURPOSE. Please see the CERN OHL v.1.1 for applicable conditions.
- Contact
- File
- Last Mod.
- Print Date
- Sheet
- Size
- A3
- of
- Rev
- (in symbol R0402_100R_1%_0.0625W_100PPM) 1%
- (in symbol R0402_200R_1%_0.0625W_100PPM) 1%

### Library data of the parts
C150 C151 C154 C155 C158-C166 = CC0201_100NF_6.3V_10%_X5R: Non-polarised capacitor; Manufacturer: GENERIC; Manufacturer1 Part Number: 02016D104KAT2A; Part Description: SMD Multilayer Chip Ceramic Capacitor; TC: X5R; Tolerance: ±10%; Voltage: 6.3V; Case: 0201; Manufacturer Part Number: CC0201_100NF_6.3V_10%_X5R; Manufacturer1 Example: AVX; Part Number: CC0201_100NF_6.3V_10%_X5R; Pin Count: 2; SMD: Yes; Status: Not Recommended; Value: 100nF; Component Kind: Standard; Component Type: Standard; Mounted: Yes; Socket: No; Sense: No; Manufacturer1 ComponentHeight: 0.33mm; HelpURL: \\cern.ch\dfs\Applications\Altium\Datasheets\CC0201_X5R_AVX.pdf; Author: CERN DEM JLC; CreateDate: 03.12.2007; LatestRevisionDate: 03.12.2007
IC27 = CMP-0383-00015-1: Artix-7 FPGA, 150 User I/Os, 4 GTP, 324-Ball BGA, Speed Grade 3, Extended Grade, Pb-Free; Manufacturer: Xilinx; CMTs: 5; Available User I/O: 150; GTP: 4; Speed Grades: 3; Total Block RAM: 1800 Kb; Logic Cells: 33280; ComponentLink3URL: http://www.xilinx.com/support/documentation/user_guides/ug475_7Series_Pkg_Pinout.pdf; ComponentLink3Description: Pinout; Operating Temperature Range: Extended; PackageReference: CSG-325; PackageDescription: 324-Ball Wire-Bond Chip-Scale BGA, Body 15 x 15 mm, Pitch 0.8 mm; ComponentLink4URL: http://www.xilinx.com/support/documentation/user_guides/ug475_7Series_Pkg_Pinout.pdf; ComponentLink1Description: Manufacturer URL; ComponentLink2Description: Datasheet; DatasheetVersion: Rev. 1.15; PartNumber: XC7A35T-3CSG325E; Mounting Technology: Surface Mount; ComponentLink1URL: http://www.xilinx.com/; PackageVersion: Rev. 1.11; ComponentLink2URL: http://www.xilinx.com/support/documentation/data_sheets/ds180_7Series_Overview.pdf; Maximum Distributed RAM: 400 Kb; ComponentLink4Description: Package Specification
J13 = MOLEX_67800-5005: 7 Pin SATA Receptacle; Manufacturer: MOLEX; Part Description: 1.27mm Pitch, 7 Contacts, Serial ATA High Speed Header, Straight with Locking Latch; PressFit: No; Manufacturer Part Number: 67800-5005; Part Number: MOLEX_67800-5005; Component Kind: Standard; Component Type: Standard; Pin Count: 7; Family: SATA; Mounted: Yes; Socket: No; SMD: Yes; Sense: No; Status: None; ComponentHeight: 8.4mm; HelpURL: \\cern.ch\dfs\Applications\Altium\Datasheets\MOLEX_67800-5005.pdf; Author: CERN DEM MR; CreateDate: 01.12.2016; LatestRevisionDate: 01.12.2016
L34 = IND0402_MURATA_BLM15PX121SN1D: Manufacturer: MURATA; Part Description: SMD EMIFIL Chip Ferrite Bead; Power: 2A; Resistance: 0.055R; Tolerance: ±25%; Case: 0402; ComponentHeight: 0.55mm; Manufacturer Part Number: BLM15PX121SN1D; Part Number: IND0402_MURATA_BLM15PX121SN1D; Pin Count: 2; SMD: Yes; Value: 120R@100MHz; Component Kind: Standard; Component Type: Standard; Status: None; Mounted: Yes; Socket: No; Sense: No; HelpURL: \\cern.ch\dfs\Applications\Altium\Datasheets\IND0402_MURATA_BLM15PX.pdf; Author: CERN DEM JMW; CreateDate: 19.02.2014; LatestRevisionDate: 25.10.2018
OSC2 = OSC_125MHZ_SILICON-LAB_510FBA125M000AAG: Crystal Oscillator 6 pins, Si510 (LVDS/LVPECL/HCSL/Dual CMOS); Part Description: 2.5V ±25ppm LVDS Crystal Oscillator (XO), Si510 Series; Manufacturer: SILICON LABS; PressFit: No; Bonding: No; Part Number: OSC_125MHZ_SILICON-LAB_510FBA125M000AAG; Component Kind: Standard; Component Type: Standard; PackageDescription: Oscillator Si510 Series, 6 pins, 5x7mm; Value: 125MHz; Pin Count: 6; Mounted: Yes; Socket: No; SMD: Yes; Sense: No; ComponentHeight: 1.8mm; HelpURL: \\cern.ch\dfs\Applications\Altium\Datasheets\OSC_SILICON-LAB_SI510.pdf; Author: CERN DEM JMW; CreateDate: 10.08.2015; LatestRevisionDate: 26.11.2018
R35 = R0402_100R_1%_0.0625W_100PPM: Resistor - 1%; Manufacturer: GENERIC; Manufacturer1 Part Number: 232270671001L; Part Description: General Purpose Thick Film Chip Resistor; TC: ±100ppm/°C; PressFit: No; Case: 0402; Manufacturer Part Number: R0402_100R_1%_0.0625W_100PPM; Manufacturer1 ComponentHeight: 0.4mm; Manufacturer1 Example: YAGEO PHYCOMP; Part Number: R0402_100R_1%_0.0625W_100PPM; Pin Count: 2; Power: 0.0625W; Sense: No; SMD: Yes; Status: Not Recommended; Tolerance: ±1%; Value: 100; Component Kind: Standard; Component Type: Standard; Mounted: Yes; Socket: No; HelpURL: \\cern.ch\dfs\Applications\Altium\Datasheets\R0402_Phycomp_RC0402.pdf; Author: CERN DEM JLC; CreateDate: 03.12.2007; LatestRevisionDate: 17.10.2012
R96 R98 = R0402_200R_1%_0.0625W_100PPM: Resistor - 1%; Manufacturer: GENERIC; Manufacturer1 Part Number: 232270672001L; Part Description: General Purpose Thick Film Chip Resistor; TC: ±100ppm/°C; PressFit: No; Case: 0402; Manufacturer Part Number: R0402_200R_1%_0.0625W_100PPM; Manufacturer1 ComponentHeight: 0.4mm; Manufacturer1 Example: YAGEO PHYCOMP; Part Number: R0402_200R_1%_0.0625W_100PPM; Pin Count: 2; Power: 0.0625W; Sense: No; SMD: Yes; Status: Not Recommended; Tolerance: ±1%; Value: 200; Component Kind: Standard; Component Type: Standard; Mounted: Yes; Socket: No; HelpURL: \\cern.ch\dfs\Applications\Altium\Datasheets\R0402_Phycomp_RC0402.pdf; Author: CERN DEM JLC; CreateDate: 03.12.2007; LatestRevisionDate: 17.10.2012

## Sheet FPGA_7A35T_POWER.SchDoc: Sayma RTM
size 420 x 297 mm; $$Internal___BlkDate: 23:43:25_12-13-18; $$Internal_NAME_PLACEHOLDER: a3sheet; $$Internal_Resolution: 00001mm; $$NotCommonProperty_@NAME: FPGA_7A15T_POWER; $$NotCommonProperty_@PRINTORDER: 2; $$NotCommonProperty_@SHEET: 1; $$NotCommonProperty_@SHEETTOTAL: 1; CmpIndex: 0; Drawing Author: G.Kasprowicz; Drawing Number: Sayma RTM; Drawing Project: 8 channel SAWG; Drawing Revision: 2.0; SymIndex: 2227; Author: G.Kasprowicz; CompanyName: WUT ISE; DrawnBy: G.Kasprowicz; Organization: WUT ISE; Address1: PW ISE; Address2: Nowowiejska 15/19 00-665 Warsaw; Address3: gkasprow@gmail.com; DocumentNumber: 9; Revision: 1.0; SheetNumber: 9; SheetTotal: 18; ModifiedBy: -; CheckedDate: -; Title2: FPGA supply; DivGrp: WUT ISE; Designer: G.Kasprowicz; ModifiedDate: -; ProjectName: Sensor Box
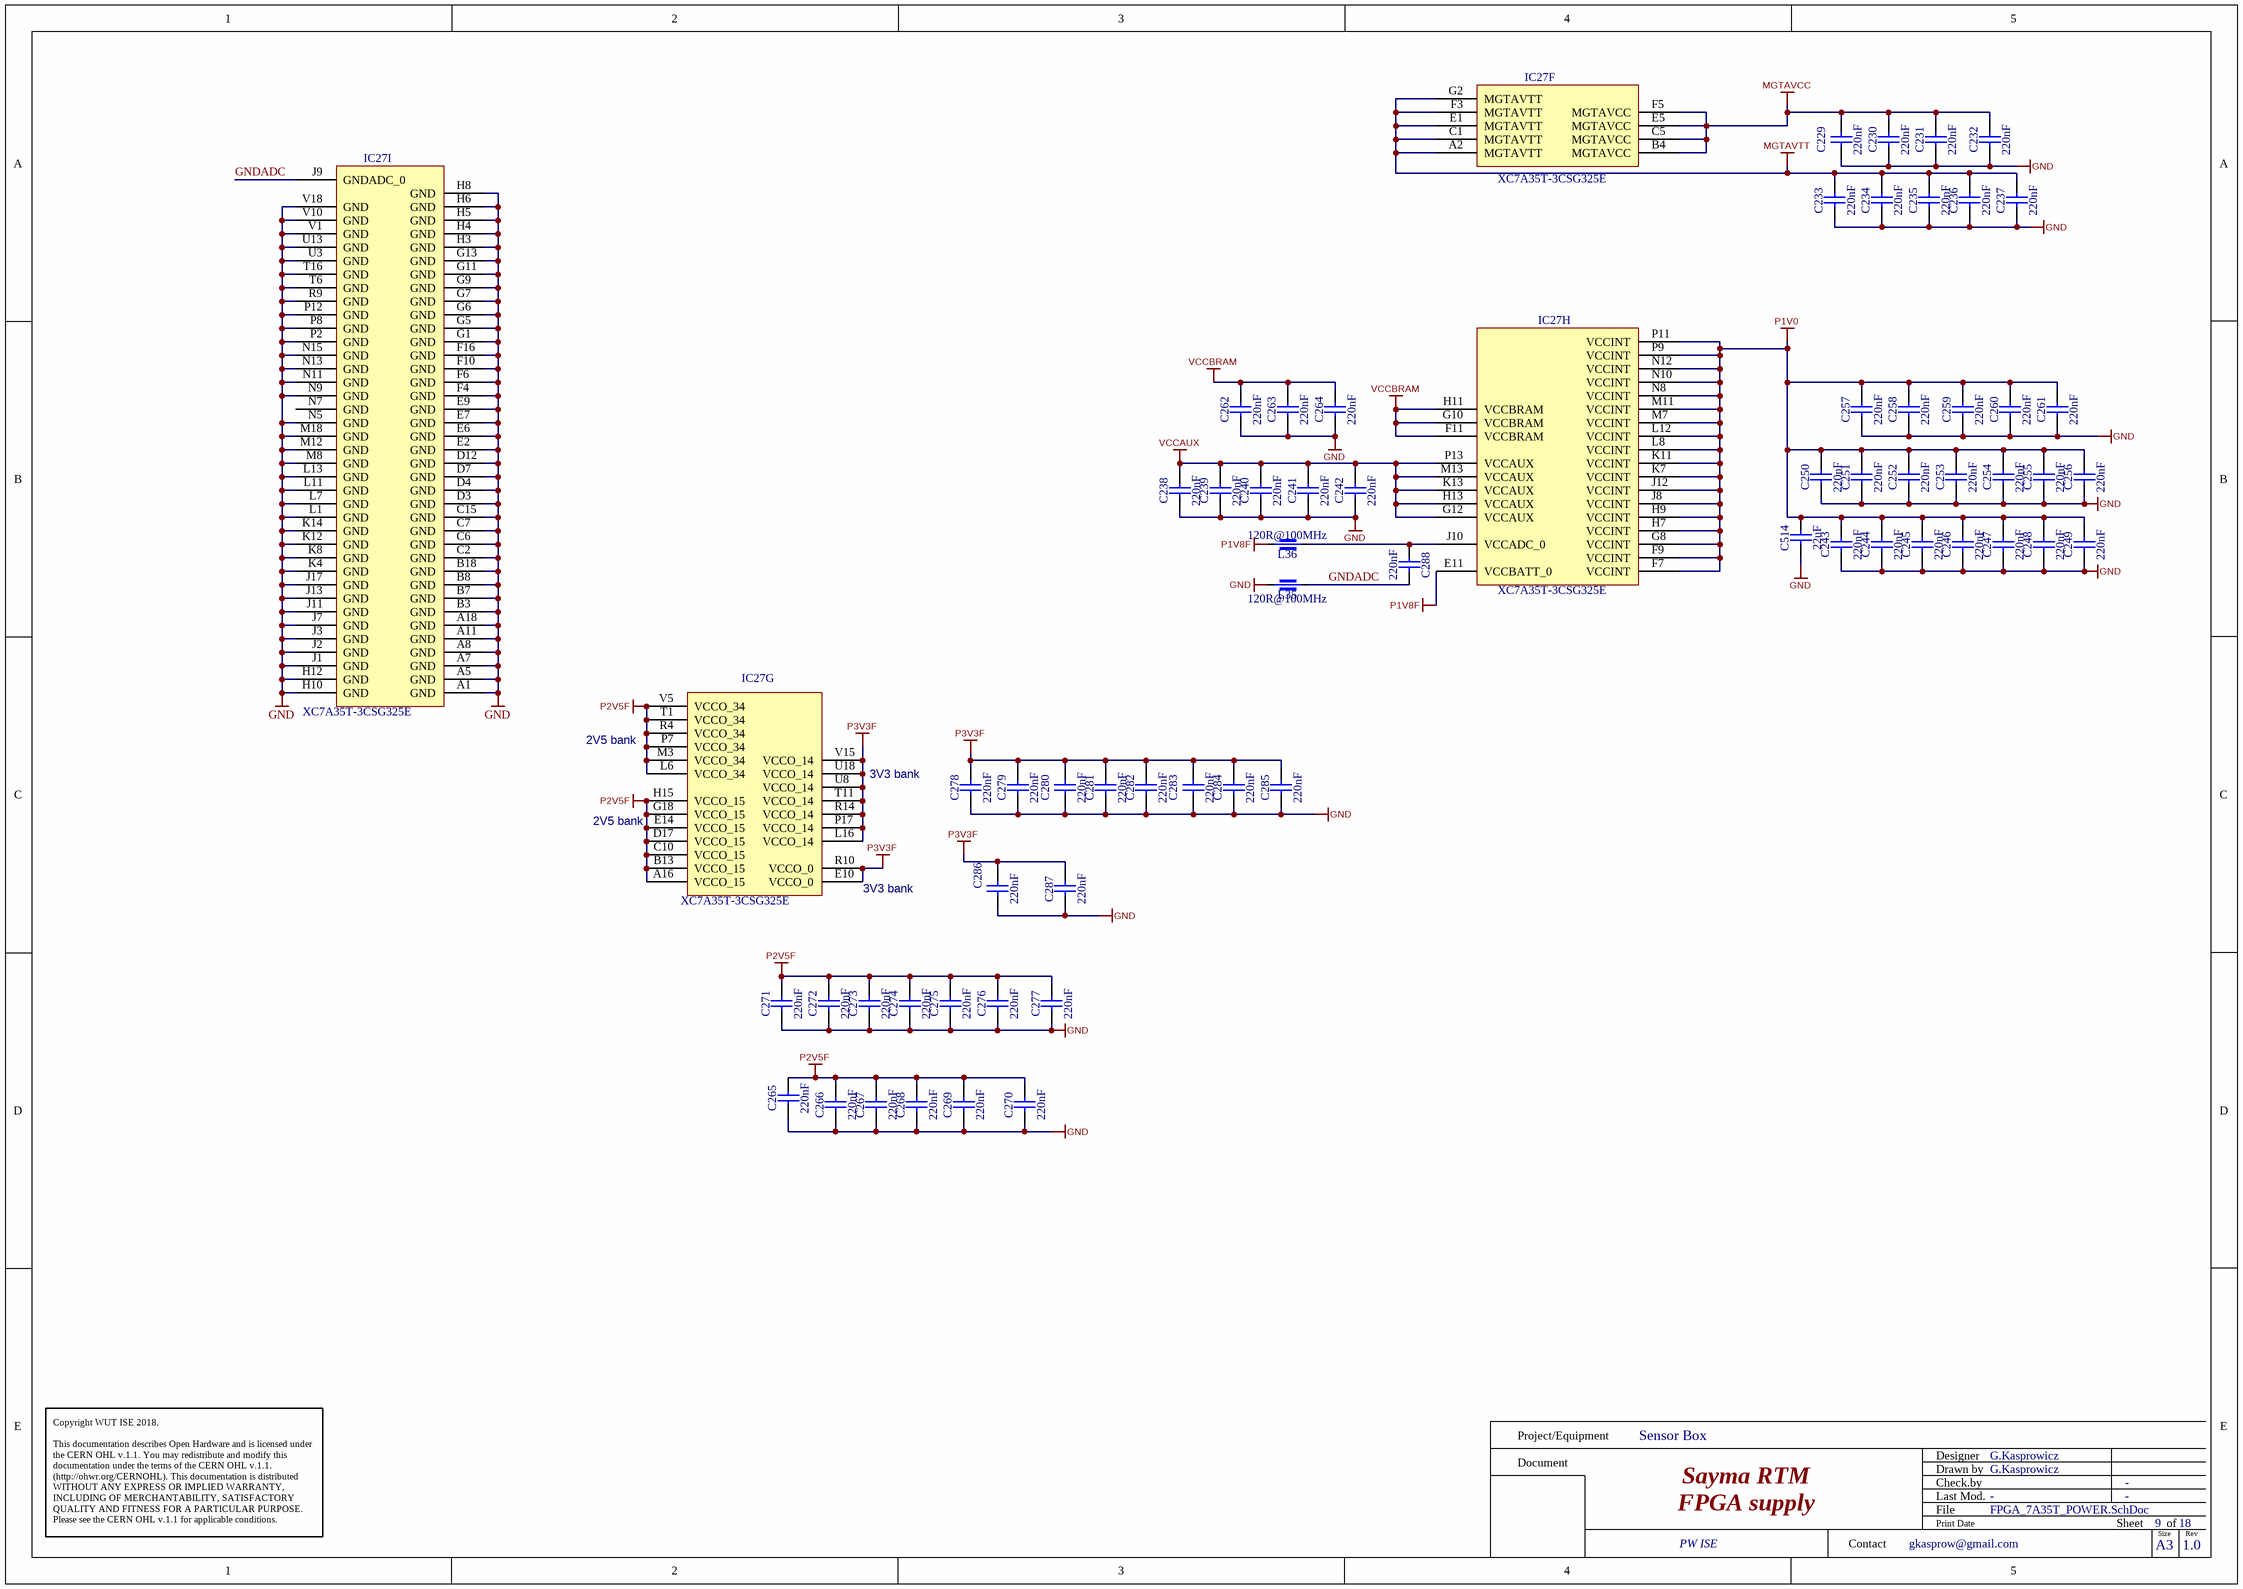
[diagram p17: FPGA_7A35T_POWER.SchDoc]

### Parts
C229  220nF  [CAPC0603X33N]
C230  220nF  [CAPC0603X33N]
C231  220nF  [CAPC0603X33N]
C232  220nF  [CAPC0603X33N]
C233  220nF  [CAPC0603X33N]
C234  220nF  [CAPC0603X33N]
C235  220nF  [CAPC0603X33N]
C236  220nF  [CAPC0603X33N]
C237  220nF  [CAPC0603X33N]
C238  220nF  [CAPC0603X33N]
C239  220nF  [CAPC0603X33N]
C240  220nF  [CAPC0603X33N]
C241  220nF  [CAPC0603X33N]
C242  220nF  [CAPC0603X33N]
C243  220nF  [CAPC0603X33N]
C244  220nF  [CAPC0603X33N]
C245  220nF  [CAPC0603X33N]
C246  220nF  [CAPC0603X33N]
C247  220nF  [CAPC0603X33N]
C248  220nF  [CAPC0603X33N]
C249  220nF  [CAPC0603X33N]
C250  220nF  [CAPC0603X33N]
C251  220nF  [CAPC0603X33N]
C252  220nF  [CAPC0603X33N]
C253  220nF  [CAPC0603X33N]
C254  220nF  [CAPC0603X33N]
C255  220nF  [CAPC0603X33N]
C256  220nF  [CAPC0603X33N]
C257  220nF  [CAPC0603X33N]
C258  220nF  [CAPC0603X33N]
C259  220nF  [CAPC0603X33N]
C260  220nF  [CAPC0603X33N]
C261  220nF  [CAPC0603X33N]
C262  220nF  [CAPC0603X33N]
C263  220nF  [CAPC0603X33N]
C264  220nF  [CAPC0603X33N]
C265  220nF  [CAPC0603X33N]
C266  220nF  [CAPC0603X33N]
C267  220nF  [CAPC0603X33N]
C268  220nF  [CAPC0603X33N]
C269  220nF  [CAPC0603X33N]
C270  220nF  [CAPC0603X33N]
C271  220nF  [CAPC0603X33N]
C272  220nF  [CAPC0603X33N]
C273  220nF  [CAPC0603X33N]
C274  220nF  [CAPC0603X33N]
C275  220nF  [CAPC0603X33N]
C276  220nF  [CAPC0603X33N]
C277  220nF  [CAPC0603X33N]
C278  220nF  [CAPC0603X33N]
C279  220nF  [CAPC0603X33N]
C280  220nF  [CAPC0603X33N]
C281  220nF  [CAPC0603X33N]
C282  220nF  [CAPC0603X33N]
C283  220nF  [CAPC0603X33N]
C284  220nF  [CAPC0603X33N]
C285  220nF  [CAPC0603X33N]
C286  220nF  [CAPC0603X33N]
C287  220nF  [CAPC0603X33N]
C288  220nF  [CAPC0603X33N]
C514  22uF  [CAPC2012X135N]
IC27  XC7A35T-3CSG325E  [CSG325]  (parts F,G,H,I of 9)
L35  120R@100MHz  [INDC1005X55N]
L36  120R@100MHz  [INDC1005X55N]

### Nets
GND: C229.1 C230.1 C231.1 C232.1 C233.1 C234.1 C235.1 C236.1 C237.1 C238.1 C239.1 C240.1 C241.1 C242.1 C243.1 C244.1 C245.1 C246.1 C247.1 C248.1 C249.1 C250.1 C251.1 C252.1 C253.1 C254.1 C255.1 C256.1 C257.1 C258.1 C259.1 C260.1 C261.1 C262.1 C263.1 C264.1 C265.1 C266.1 C267.1 C268.1 C269.1 C270.1 C271.1 C272.1 C273.1 C274.1 C275.1 C276.1 C277.1 C278.1 C279.1 C280.1 C281.1 C282.1 C283.1 C284.1 C285.1 C286.1 C287.1 C514.1 IC27.A1(GND) IC27.A5(GND) IC27.A7(GND) IC27.A8(GND) IC27.A11(GND) IC27.A18(GND) IC27.B3(GND) IC27.B7(GND) IC27.B8(GND) IC27.B18(GND) IC27.C2(GND) IC27.C6(GND) IC27.C7(GND) IC27.C15(GND) IC27.D3(GND) IC27.D4(GND) IC27.D7(GND) IC27.D12(GND) IC27.E2(GND) IC27.E6(GND) IC27.E7(GND) IC27.E9(GND) IC27.F4(GND) IC27.F6(GND) IC27.F10(GND) IC27.F16(GND) IC27.G1(GND) IC27.G5(GND) IC27.G6(GND) IC27.G7(GND) IC27.G9(GND) IC27.G11(GND) IC27.G13(GND) IC27.H3(GND) IC27.H4(GND) IC27.H5(GND) IC27.H6(GND) IC27.H8(GND) IC27.H10(GND) IC27.H12(GND) IC27.J1(GND) IC27.J2(GND) IC27.J3(GND) IC27.J7(GND) IC27.J11(GND) IC27.J13(GND) IC27.J17(GND) IC27.K4(GND) IC27.K8(GND) IC27.K12(GND) IC27.K14(GND) IC27.L1(GND) IC27.L7(GND) IC27.L11(GND) IC27.L13(GND) IC27.M8(GND) IC27.M12(GND) IC27.M18(GND) IC27.N5(GND) IC27.N9(GND) IC27.N11(GND) IC27.N13(GND) IC27.N15(GND) IC27.P2(GND) IC27.P8(GND) IC27.P12(GND) IC27.R9(GND) IC27.T6(GND) IC27.T16(GND) IC27.U3(GND) IC27.U13(GND) IC27.V1(GND) IC27.V10(GND) IC27.V18(GND) L35.1
MGTAVCC: C229.2 C230.2 C231.2 C232.2 IC27.B4(MGTAVCC) IC27.C5(MGTAVCC) IC27.E5(MGTAVCC) IC27.F5(MGTAVCC)
MGTAVTT: C233.2 C234.2 C235.2 C236.2 C237.2 IC27.A2(MGTAVTT) IC27.C1(MGTAVTT) IC27.E1(MGTAVTT) IC27.F3(MGTAVTT) IC27.G2(MGTAVTT)
P1V0: C243.2 C244.2 C245.2 C246.2 C247.2 C248.2 C249.2 C250.2 C251.2 C252.2 C253.2 C254.2 C255.2 C256.2 C257.2 C258.2 C259.2 C260.2 C261.2 C514.2 IC27.F7(VCCINT) IC27.F9(VCCINT) IC27.G8(VCCINT) IC27.H7(VCCINT) IC27.H9(VCCINT) IC27.J8(VCCINT) IC27.J12(VCCINT) IC27.K7(VCCINT) IC27.K11(VCCINT) IC27.L8(VCCINT) IC27.L12(VCCINT) IC27.M7(VCCINT) IC27.M11(VCCINT) IC27.N8(VCCINT) IC27.N10(VCCINT) IC27.N12(VCCINT) IC27.P9(VCCINT) IC27.P11(VCCINT)
P1V8F: IC27.E11(VCCBATT_0) L36.1
P2V5F: C265.2 C266.2 C267.2 C268.2 C269.2 C270.2 C271.2 C272.2 C273.2 C274.2 C275.2 C276.2 C277.2 IC27.A16(VCCO_15) IC27.B13(VCCO_15) IC27.C10(VCCO_15) IC27.D17(VCCO_15) IC27.E14(VCCO_15) IC27.G18(VCCO_15) IC27.H15(VCCO_15) IC27.L6(VCCO_34) IC27.M3(VCCO_34) IC27.P7(VCCO_34) IC27.R4(VCCO_34) IC27.T1(VCCO_34) IC27.V5(VCCO_34)
P3V3F: C278.2 C279.2 C280.2 C281.2 C282.2 C283.2 C284.2 C285.2 C286.2 C287.2 IC27.E10(VCCO_0) IC27.L16(VCCO_14) IC27.P17(VCCO_14) IC27.R10(VCCO_0) IC27.R14(VCCO_14) IC27.T11(VCCO_14) IC27.U8(VCCO_14) IC27.U18(VCCO_14) IC27.V15(VCCO_14)
VCCAUX: C238.2 C239.2 C240.2 C241.2 C242.2 IC27.G12(VCCAUX) IC27.H13(VCCAUX) IC27.K13(VCCAUX) IC27.M13(VCCAUX) IC27.P13(VCCAUX)
VCCBRAM: C262.2 C263.2 C264.2 IC27.F11(VCCBRAM) IC27.G10(VCCBRAM) IC27.H11(VCCBRAM)
GNDADC: C288.2 IC27.J9(GNDADC_0) L35.2
NetC288_1: C288.1 IC27.J10(VCCADC_0) L36.2

Not connected (* = marked no-connect by the designer): IC27 N7(GND)

### Notes on the sheet
- (near IC27) 2V5 bank
- 3V3 bank
- (near IC27) 3V3 bank
- Project/Equipment
- Document
- Designer
- Drawn by
- Check.by
- Copyright WUT ISE 2018.
  This documentation describes Open Hardware and is licensed under the CERN OHL v.1.1. You may redistribute and modify this documentation under the terms of the CERN OHL v.1.1. (http://ohwr.org/CERNOHL). This documentation is distributed WITHOUT ANY EXPRESS OR IMPLIED WARRANTY, INCLUDING OF MERCHANTABILITY, SATISFACTORY QUALITY AND FITNESS FOR A PARTICULAR PURPOSE. Please see the CERN OHL v.1.1 for applicable conditions.
- Contact
- File
- Last Mod.
- Print Date
- Sheet
- Size
- A3
- of
- Rev

### Library data of the parts
C229-C288 = CC0201_220NF_6.3V_20%_X5R: Non-polarised capacitor; Manufacturer: GENERIC; Manufacturer1 Part Number: JMK063BJ224MP-F; Part Description: SMD Multilayer Chip Ceramic Capacitor; TC: X5R; Tolerance: ±20%; Voltage: 6.3V; Case: 0201; Manufacturer Part Number: CC0201_220NF_6.3V_20%_X5R; Manufacturer1 Example: TAIYO YUDEN; Part Number: CC0201_220NF_6.3V_20%_X5R; Pin Count: 2; SMD: Yes; Status: Not Recommended; Value: 220nF; Component Kind: Standard; Component Type: Standard; Mounted: Yes; Socket: No; Sense: No; Manufacturer1 ComponentHeight: 0.33mm; HelpURL: \\cern.ch\dfs\Applications\Altium\Datasheets\CC0201_X5R_TAIYO-YUDEN_STANDARD-CLASS2.pdf; Author: CERN DEM JLC; CreateDate: 27.05.2010; LatestRevisionDate: 27.05.2010
C514 = CC0805_22UF_6.3V_20%_X5R: Non-polarised capacitor; Manufacturer: GENERIC; Manufacturer1 Part Number: C0805C226M9PAC7800; Part Description: SMD Multilayer Chip Ceramic Capacitor; TC: X5R; Tolerance: ±20%; Voltage: 6.3V; Case: 0805; Manufacturer Part Number: CC0805_22UF_6.3V_20%_X5R; Manufacturer1 Example: KEMET; Part Number: CC0805_22UF_6.3V_20%_X5R; Pin Count: 2; SMD: Yes; Status: Preferred; Value: 22uF; Component Kind: Standard; Component Type: Standard; Mounted: Yes; Socket: No; Sense: No; Manufacturer1 ComponentHeight: 1.45mm; HelpURL: \\cern.ch\dfs\Applications\Altium\Datasheets\CC1206_X5R_KEMET.pdf; Author: CERN DEM JLC; CreateDate: 03.12.2007; LatestRevisionDate: 03.12.2007
IC27 = CMP-0383-00015-1: as IC27 on sheet FPGA_7A35T_GTP; ComponentLink3URL: http://www.xilinx.com/support/documentation/user_guides/ug475_7Series_Pkg_Pinout.pdf; ComponentLink3Description: Pinout; Operating Temperature Range: Extended; PackageReference: CSG-325; PackageDescription: 324-Ball Wire-Bond Chip-Scale BGA, Body 15 x 15 mm, Pitch 0.8 mm; ComponentLink4URL: http://www.xilinx.com/support/documentation/user_guides/ug475_7Series_Pkg_Pinout.pdf; ComponentLink1Description: Manufacturer URL; ComponentLink2Description: Datasheet; DatasheetVersion: Rev. 1.15; PartNumber: XC7A35T-3CSG325E; Mounting Technology: Surface Mount; ComponentLink1URL: http://www.xilinx.com/; PackageVersion: Rev. 1.11; ComponentLink2URL: http://www.xilinx.com/support/documentation/data_sheets/ds180_7Series_Overview.pdf; Maximum Distributed RAM: 400 Kb; ComponentLink4Description: Package Specification
L35 L36 = IND0402_MURATA_BLM15PX121SN1D: as L34 on sheet FPGA_7A35T_GTP; Case: 0402; ComponentHeight: 0.55mm; Manufacturer Part Number: BLM15PX121SN1D; Part Number: IND0402_MURATA_BLM15PX121SN1D; Pin Count: 2; SMD: Yes; Value: 120R@100MHz; Component Kind: Standard; Component Type: Standard; Status: None; Mounted: Yes; Socket: No; Sense: No; HelpURL: \\cern.ch\dfs\Applications\Altium\Datasheets\IND0402_MURATA_BLM15PX.pdf; Author: CERN DEM JMW; CreateDate: 19.02.2014; LatestRevisionDate: 25.10.2018